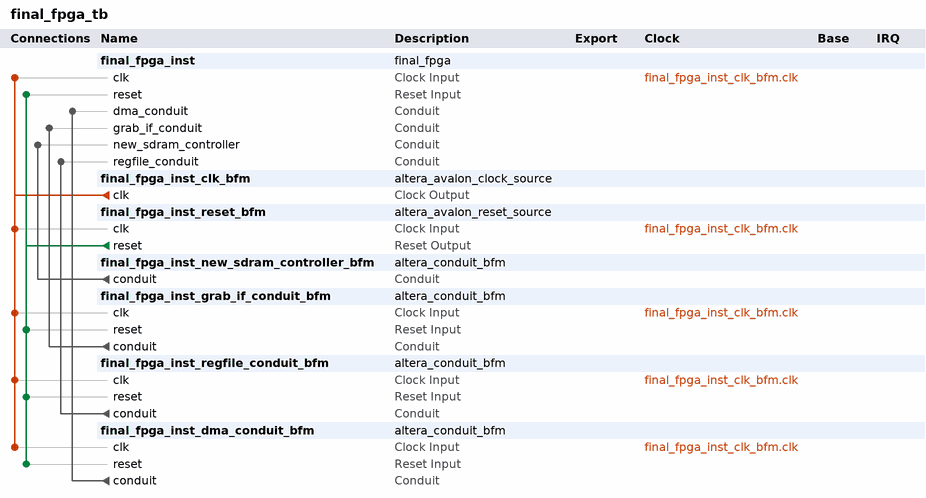
[diagram p0: system contents]
# Platform Designer (Qsys) system final_fpga_tb, Cyclone II EP2C35F672C6
# Parameters at their usual value, and those the tool derives, are not listed.
package require -exact qsys 13.0
create_system final_fpga_tb
set_project_property DEVICE_FAMILY {Cyclone II}
set_project_property DEVICE EP2C35F672C6

add_instance final_fpga_inst final_fpga 1.0

add_instance final_fpga_inst_clk_bfm altera_avalon_clock_source 13.0
set_instance_parameter_value final_fpga_inst_clk_bfm CLOCK_RATE 100000000

add_instance final_fpga_inst_reset_bfm altera_avalon_reset_source 13.0
set_instance_parameter_value final_fpga_inst_reset_bfm ASSERT_HIGH_RESET 0
set_instance_parameter_value final_fpga_inst_reset_bfm INITIAL_RESET_CYCLES 50

add_instance final_fpga_inst_new_sdram_controller_bfm altera_conduit_bfm 13.0
set_instance_parameter_value final_fpga_inst_new_sdram_controller_bfm CLOCKED_SIGNAL false
set_instance_parameter_value final_fpga_inst_new_sdram_controller_bfm ENABLE_RESET false
set_instance_parameter_value final_fpga_inst_new_sdram_controller_bfm SIGNAL_ROLES addr,ba,cas_n,cke,cs_n,dq,dqm,ras_n,we_n
set_instance_parameter_value final_fpga_inst_new_sdram_controller_bfm SIGNAL_WIDTHS 12,2,1,1,1,16,2,1,1
set_instance_parameter_value final_fpga_inst_new_sdram_controller_bfm SIGNAL_DIRECTIONS input,input,input,input,input,bidir,input,input,input

add_instance final_fpga_inst_grab_if_conduit_bfm altera_conduit_bfm 13.0
set_instance_parameter_value final_fpga_inst_grab_if_conduit_bfm CLOCKED_SIGNAL true
set_instance_parameter_value final_fpga_inst_grab_if_conduit_bfm ENABLE_RESET true
set_instance_parameter_value final_fpga_inst_grab_if_conduit_bfm SIGNAL_ROLES gclk,vdata,GSSHT,GMODE,GCONT,GFMT,GFSTART,GLPITCH,GYSS,GXSS,GACTIVE,GSPDG,DEBUG_GRABIF1,DEBUG_GRABIF2
set_instance_parameter_value final_fpga_inst_grab_if_conduit_bfm SIGNAL_WIDTHS 1,8,1,2,1,1,23,23,2,2,1,1,32,32
set_instance_parameter_value final_fpga_inst_grab_if_conduit_bfm SIGNAL_DIRECTIONS output,output,output,output,output,output,output,output,output,output,input,input,input,input

add_instance final_fpga_inst_regfile_conduit_bfm altera_conduit_bfm 13.0
set_instance_parameter_value final_fpga_inst_regfile_conduit_bfm CLOCKED_SIGNAL true
set_instance_parameter_value final_fpga_inst_regfile_conduit_bfm ENABLE_RESET true
set_instance_parameter_value final_fpga_inst_regfile_conduit_bfm SIGNAL_ROLES GSPDG,GACTIVE,GFMT,GMODE,GXSS,GYSS,GFSTART,GLPITCH,SOFIEN,DMAEN,DMALR,DMAFSTART,DMALPITCH,DMAXSIZE,VGAHZOOM,VGAVZOOM,PFMT,HTOTAL,HSSYNC,HESYNC,HSVALID,HEVALID,VTOTAL,VSSYNC,VESYNC,VSVALID,VEVALID,GACTIVE_IN,GSPDG_IN,GSSHT,SOFISTS,EOFIEN
set_instance_parameter_value final_fpga_inst_regfile_conduit_bfm SIGNAL_WIDTHS 1,1,1,2,2,2,23,23,1,1,1,23,23,16,2,2,2,16,16,16,16,16,16,16,16,16,16,1,1,1,1,1
set_instance_parameter_value final_fpga_inst_regfile_conduit_bfm SIGNAL_DIRECTIONS input,input,input,input,input,input,input,input,input,input,input,input,input,input,input,input,input,input,input,input,input,input,input,input,input,input,input,output,output,input,input,input

add_instance final_fpga_inst_dma_conduit_bfm altera_conduit_bfm 13.0
set_instance_parameter_value final_fpga_inst_dma_conduit_bfm CLOCKED_SIGNAL true
set_instance_parameter_value final_fpga_inst_dma_conduit_bfm ENABLE_RESET true
set_instance_parameter_value final_fpga_inst_dma_conduit_bfm SIGNAL_ROLES DMAEN,DMALR,DMAFSTART,DMALPITCH,DMAXSIZE,data,write_address,write_enable,read_enable,SOL_in,SOF_in
set_instance_parameter_value final_fpga_inst_dma_conduit_bfm SIGNAL_WIDTHS 1,1,23,23,16,32,11,1,1,1,1
set_instance_parameter_value final_fpga_inst_dma_conduit_bfm SIGNAL_DIRECTIONS output,output,output,output,output,input,input,input,output,output,output

# connections
add_connection final_fpga_inst_clk_bfm.clk final_fpga_inst.clk clock
add_connection final_fpga_inst_clk_bfm.clk final_fpga_inst_dma_conduit_bfm.clk clock
add_connection final_fpga_inst_clk_bfm.clk final_fpga_inst_grab_if_conduit_bfm.clk clock
add_connection final_fpga_inst_clk_bfm.clk final_fpga_inst_regfile_conduit_bfm.clk clock
add_connection final_fpga_inst_clk_bfm.clk final_fpga_inst_reset_bfm.clk clock
add_connection final_fpga_inst_reset_bfm.reset final_fpga_inst.reset reset
add_connection final_fpga_inst_reset_bfm.reset final_fpga_inst_dma_conduit_bfm.reset reset
add_connection final_fpga_inst_reset_bfm.reset final_fpga_inst_grab_if_conduit_bfm.reset reset
add_connection final_fpga_inst_reset_bfm.reset final_fpga_inst_regfile_conduit_bfm.reset reset
add_connection final_fpga_inst_dma_conduit_bfm.conduit final_fpga_inst.dma_conduit conduit
add_connection final_fpga_inst_grab_if_conduit_bfm.conduit final_fpga_inst.grab_if_conduit conduit
add_connection final_fpga_inst_new_sdram_controller_bfm.conduit final_fpga_inst.new_sdram_controller conduit
add_connection final_fpga_inst_regfile_conduit_bfm.conduit final_fpga_inst.regfile_conduit conduit

set_interconnect_requirement {$system} qsys_mm.clockCrossingAdapter HANDSHAKE
set_interconnect_requirement {$system} qsys_mm.maxAdditionalLatency 1

save_system final_fpga_tb.qsys
